# EAGLE design V1.1 (EAGLE 9.5.1)
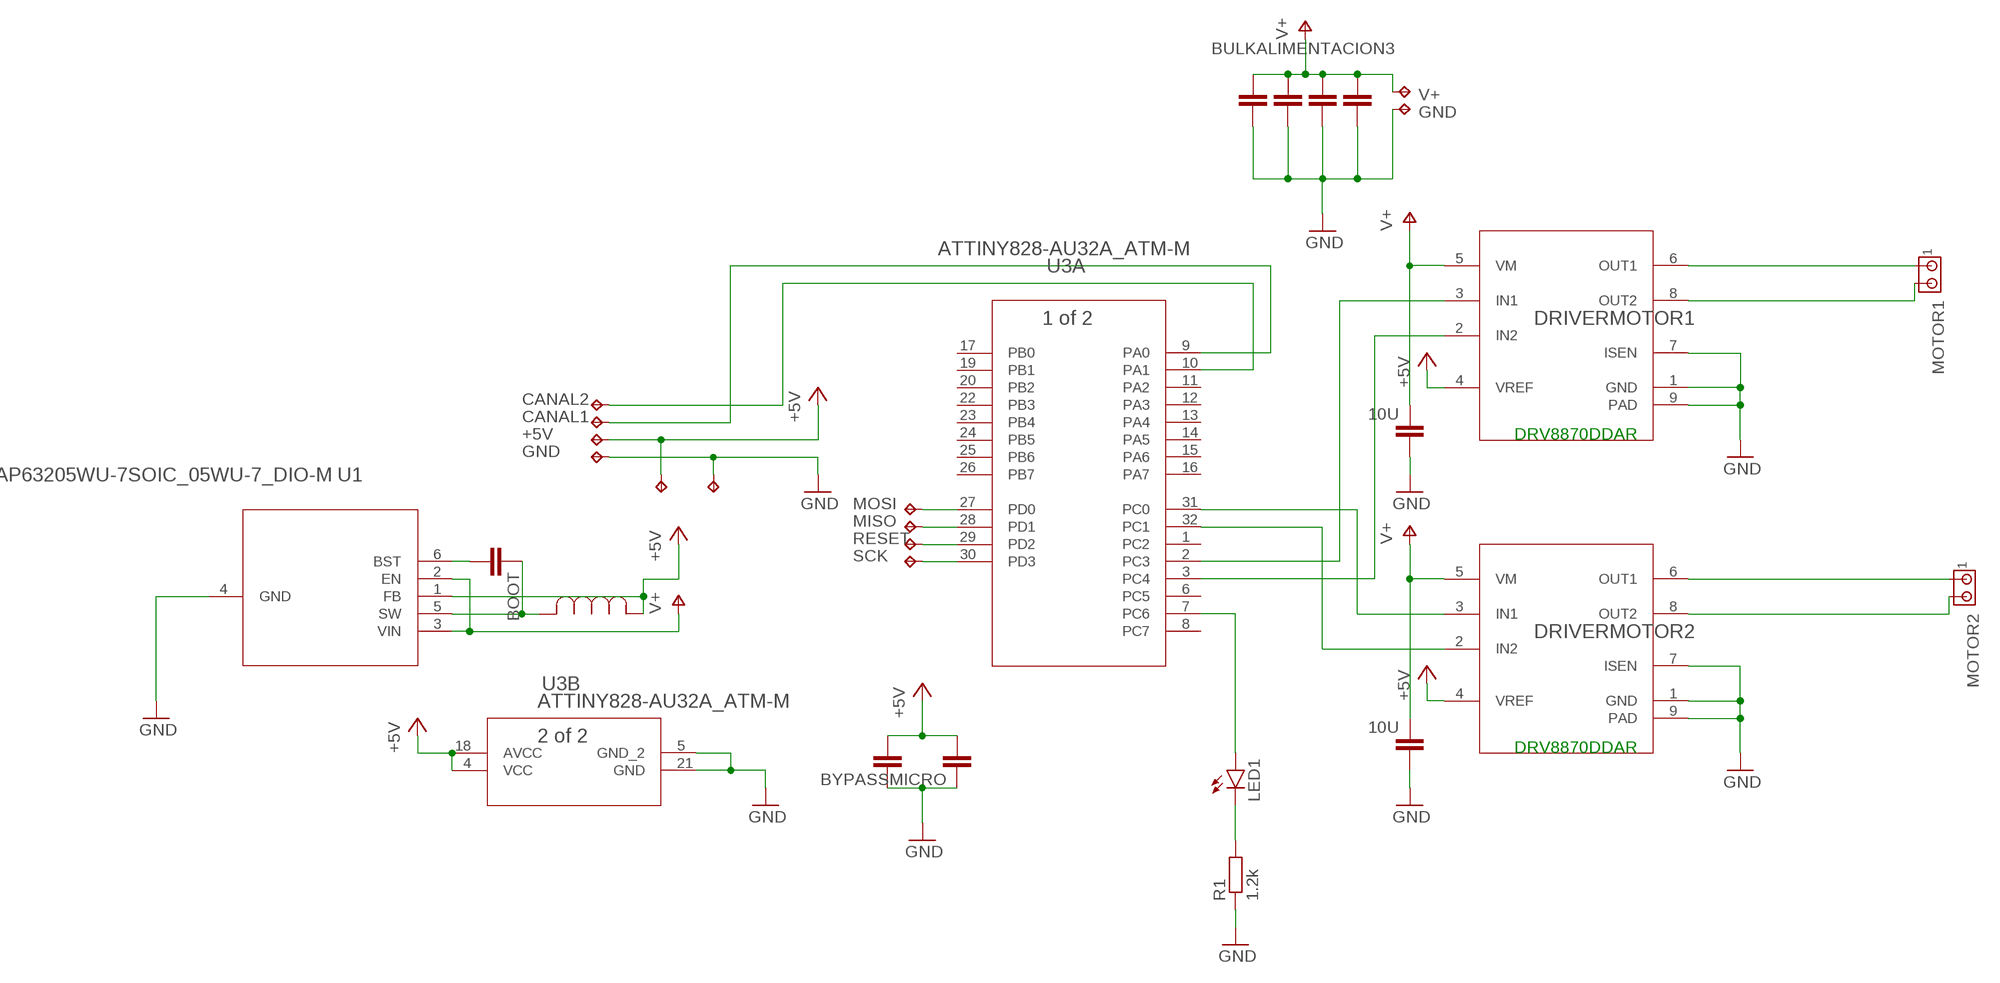
[diagram p0: schematic, sheet 1]

## Parts
BOOT  C-EUC0402  [C0402]
BULKALIMENTACION  C-EUC1206  [C1206]
BULKALIMENTACION1  C-EUC1206  [C1206]
BULKALIMENTACION2  C-EUC1206  [C1206]
BULKALIMENTACION3  C-EUC1206  [C1206]
BYPASS1  10U  C-EUC0603  [C0603]
BYPASSMICRO  C-EUC0603  [C0603]
BYPASSMICRO2  C-EUC0603  [C0603]
BYPASSMOTOR2  10U  C-EUC0603  [C0603]
DRIVERMOTOR1  DRV8870  [DDA0008H_N]
DRIVERMOTOR2  DRV8870  [DDA0008H_N]
GND  TPTP20SQ  [TP20SQ]
LED1  LEDCHIPLED_0603  [CHIPLED_0603]
MISO  TPTP12R  [TP12R]
MOTOR1  MTA02-100  [10X02MTA]
MOTOR2  MTA02-100  [10X02MTA]
R1  1.2k  R-EU_R0603  [R0603]
TP1  TPTP13SQ  [TP13SQ]
TP2  TPTP13SQ  [TP13SQ]
TP3  TPTP13SQ  [TP13SQ]
TP4  TPTP13SQ  [TP13SQ]
TP5  TPTP13SQ  [TP13SQ]
TP6  TPTP12R  [TP12R]
TP7  TPTP12R  [TP12R]
TP8  TPTP12R  [TP12R]
TP9  TPTP13SQ  [TP13SQ]
U1  AP63205WU-7SOIC_05WU-7_DIO-M  [SOIC_05WU-7_DIO-M]
U3  ATTINY828-AU32A_ATM-M  [32A_ATM-M]
U$2  INDUCTOR4.7  [IND_NRS5030T100MMGJ_TAY]
V+  TPTP20SQ  [TP20SQ]

## Nets
+5V: BYPASSMICRO2.2 BYPASSMICRO.2 DRIVERMOTOR1.4(VREF) DRIVERMOTOR2.4(VREF) TP3.TP TP9.TP U1.1(FB) U3.4(B:VCC) U3.18(B:AVCC) U$2.1
CANAL1: TP1.TP U3.9(A:PA0)
CANAL2: TP2.TP U3.10(A:PA1)
GND: BULKALIMENTACION1.2 BULKALIMENTACION2.2 BULKALIMENTACION3.2 BULKALIMENTACION.2 BYPASS1.1 BYPASSMICRO2.1 BYPASSMICRO.1 BYPASSMOTOR2.1 DRIVERMOTOR1.1(GND) DRIVERMOTOR1.7(ISEN) DRIVERMOTOR1.9(PAD) DRIVERMOTOR2.1(GND) DRIVERMOTOR2.7(ISEN) DRIVERMOTOR2.9(PAD) GND.TP R1.1 TP4.TP TP5.TP U1.4(GND) U3.5(B:GND_2) U3.21(B:GND)
MISO: TP6.TP U3.28(A:PD1)
MOSI: MISO.TP U3.27(A:PD0)
N$1: DRIVERMOTOR1.3(IN1) U3.2(A:PC3)
N$2: DRIVERMOTOR1.2(IN2) U3.3(A:PC4)
N$3: DRIVERMOTOR2.3(IN1) U3.31(A:PC0)
N$4: DRIVERMOTOR2.2(IN2) U3.32(A:PC1)
N$5: DRIVERMOTOR2.8(OUT2) MOTOR2.2
N$6: DRIVERMOTOR2.6(OUT1) MOTOR2.1
N$7: DRIVERMOTOR1.8(OUT2) MOTOR1.2
N$8: DRIVERMOTOR1.6(OUT1) MOTOR1.1
N$10: LED1.A U3.7(A:PC6)
N$15: LED1.C R1.2
N$17: BOOT.1 U1.5(SW) U$2.2
N$18: BOOT.2 U1.6(BST)
RESET: TP7.TP U3.29(A:PD2)
SCK: TP8.TP U3.30(A:PD3)
V+: BULKALIMENTACION1.1 BULKALIMENTACION2.1 BULKALIMENTACION3.1 BULKALIMENTACION.1 BYPASS1.2 BYPASSMOTOR2.2 DRIVERMOTOR1.5(VM) DRIVERMOTOR2.5(VM) U1.2(EN) U1.3(VIN) V+.TP
Unconnected: U3.1(A:PC2) U3.6(A:PC5) U3.8(A:PC7) U3.11(A:PA2) U3.12(A:PA3) U3.13(A:PA4) U3.14(A:PA5) U3.15(A:PA6) U3.16(A:PA7) U3.17(A:PB0) U3.19(A:PB1) U3.20(A:PB2) U3.22(A:PB3) U3.23(A:PB4) U3.24(A:PB5) U3.25(A:PB6) U3.26(A:PB7)

## Notes on the sheet
- DRV8870DDAR
- DRV8870DDAR

## Library data of the parts
BOOT BULKALIMENTACION BULKALIMENTACION1-BULKALIMENTACION3 BYPASS1 BYPASSMICRO BYPASSMICRO2 BYPASSMOTOR2 = rcl:C-EU: CAPACITOR, European symbol; SPICEPREFIX: C
DRIVERMOTOR1 DRIVERMOTOR2 = otrodrv:DRV8870
GND MISO TP1-TP9 V+ = testpad:TP: Test pad
LED1 = led:LED: LED OSRAM: - CHIPLED LG R971, LG N971, LY N971, LG Q971, LY Q971, LO R971, LY R971 LH N974, LH R974 LS Q976, LO Q976, LY Q976 LO Q996 - Hyper CHIPLED LW Q18S LB Q993, LB Q99A, LB R99A - SideLED LS A670, LO A670, LY A670, LG A670, LP A670 LB A673, LV A673, LT A673, LW A673 LH A674 LY A675 LS A676, LA A676, LO A676, LY A676, LW A676 LS A679, LY A679, LG A679 - Hyper Micro SIDELED® LS Y876, LA Y876, LO Y876, LY Y876 LT Y87S - SmartLED LW L88C, LW L88S LB L89C, LB L89S, LG L890 LS L89K, LO L89K, LY L89K LS L896, LA L896, LO L896, LY L896 - TOPLED LS T670, LO T670, LY T670, LG T670, LP T670 LSG T670, LSP T670, LSY T670, LOP T670, LYG T670 LG T671, LOG T671, LSG T671 LB T673, LV T673, LT T673, LW T673 LH T674 LS T676, LA T676, LO T676, LY T676, LB T676, LH T676, LSB T676, LW T676 LB T67C, LV T67C, LT T67C, LS T67K, LO T67K, LY T67K, LW E67C LS E67B, LA E67B, LO E67B, LY E67B, LB E67C, LV E67C, LT E67C LW T67C LS T679, LY T679, LG T679 LS T770, LO T770, LY T770, LG T770, LP T770 LB T773, LV T773, LT T773, LW T773 LH T774 LS E675, LA E675, LY E675, LS T675 LS T776, LA T776, LO T776, LY T776, LB T776 LHGB T686 LT T68C, LB T68C - Hyper Mini TOPLED® LB M676 - Mini TOPLED Santana® LG M470 LS M47K, LO M47K, LY M47K Source: http://www.osram.convergy.de LUXEON: - LUMILED® LXK2-PW12-R00, LXK2-PW12-S00, LXK2-PW14-U00, LXK2-PW14-V00 LXK2-PM12-R00, LXK2-PM12-S00, LXK2-PM14-U00 LXK2-PE12-Q00, LXK2-PE12-R00, LXK2-PE12-S00, LXK2-PE14-T00, LXK2-PE14-U00 LXK2-PB12-K00, LXK2-PB12-L00, LXK2-PB12-M00, LXK2-PB14-N00, LXK2-PB14-P00, LXK2-PB14-Q00 LXK2-PR12-L00, LXK2-PR12-M00, LXK2-PR14-Q00, LXK2-PR14-R00 LXK2-PD12-Q00, LXK2-PD12-R00, LXK2-PD12-S00 LXK2-PH12-R00, LXK2-PH12-S00 LXK2-PL12-P00, LXK2-PL12-Q00, LXK2-PL12-R00 Source: www.luxeon.com KINGBRIGHT: KA-3528ASYC Source: www.kingbright.com
MOTOR1 MOTOR2 = con-amp:MTA02-100: AMP connector
R1 = rcl:R-EU_: RESISTOR, European symbol; SPICEPREFIX: R
U1 = AP63205WU-7:AP63205WU-7; BUILT_BY: EMA_Matt; COPYRIGHT: Copyright (C) 2018 Accelerated Designs. All rights reserved; MANUFACTURER_PART_NUMBER: AP63205WU-7; SOURCELIBRARY: Diodes_Inc_2019-12-05; VENDOR: Diodes Inc
U3 = nuevoattiny828:ATTINY828-AU; BUILT_BY: EMA_UL_Team; MANUFACTURER_PART_NUMBER: ATTINY828-AU; SOURCELIBRARY: Atmel_2015-02-13; VENDOR: Atmel
U$2 = Inductor4.7:INDUCTOR4.7

## Board
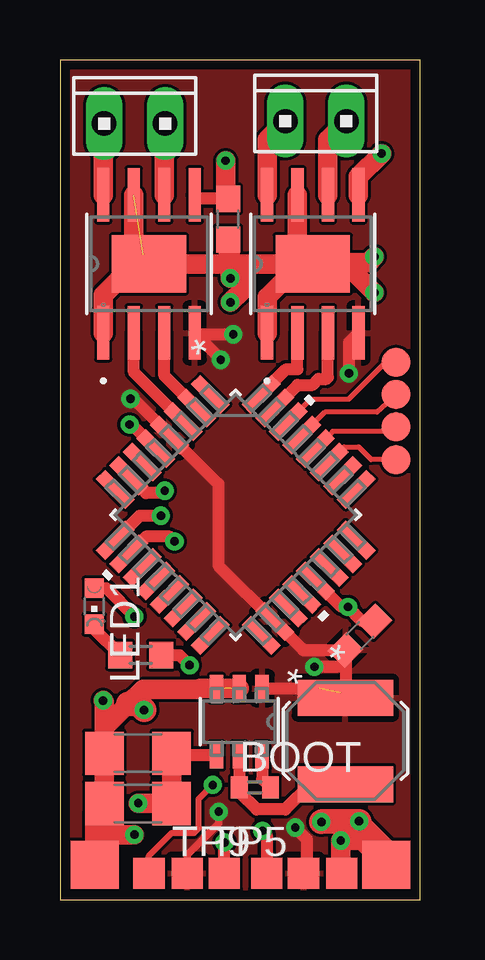
[diagram p1: board, top side]
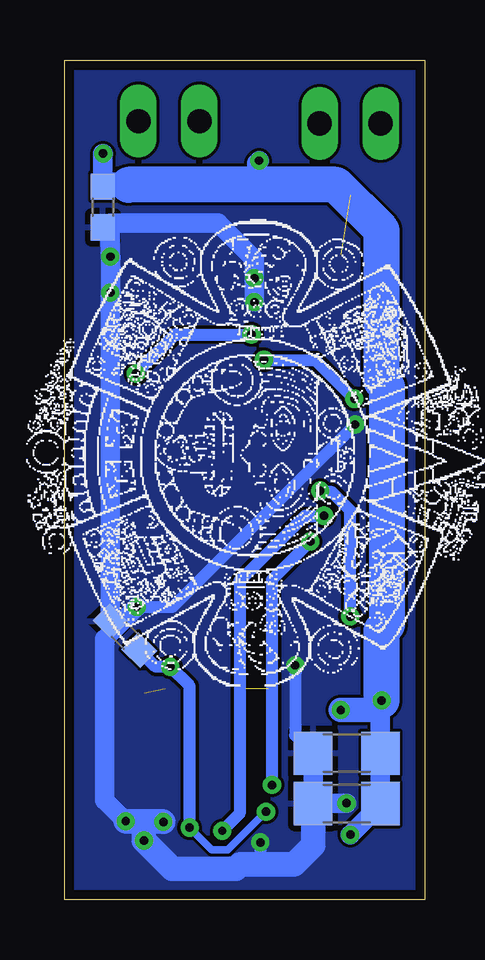
[diagram p2: board, bottom side, seen from below]

Size 15 x 35 mm. Coordinates in mm from the lower left corner, seen from the top.
Outline: 0,0 15,0 15,35 0,35 0,0
Copper layers (1*16): Top 0.035mm / dielectric 1.5mm / Bottom 0.035mm
Design rules "default *": minimum track width 6mil, minimum drill 0.35mm, track to track 5mil, track to pad 0.2mm, pad to pad 5mil, via to via 10mil, smd to smd 6mil, copper to edge 0.4mm, drill to drill 0.54mm, minimum pad ring 10mil, minimum via ring 8mil, stop-mask expansion 4mil, vias tented up to drill 0mil, thermal gap 10mil

### Footprints (pad centres in the part's own frame; a part is rotated, then mirrored left to right if it is on the bottom)
C0402 = smd 0.7 x 0.9: 1 -0.65,0; 2 0.65,0
C1206 = smd 1.6 x 1.8: 1 -1.4,0; 2 1.4,0
C0603 = smd 1.1 x 1: 1 -0.85,0; 2 0.85,0
DDA0008H_N = smd 2.21 x 0.508: 1 -2.875,1.905; 2 -2.875,0.635; 3 -2.875,-0.635; 4 -2.875,-1.905; 5 2.875,-1.905; 6 2.875,-0.635; 7 2.875,0.635; 8 2.875,1.905 | smd 2.388 x 3.099: 9 0,0
TP20SQ = smd 2 x 2: TP 0,0
CHIPLED_0603 = smd 0.8 x 0.8: A 0,-0.75; C 0,0.75
TP12R = smd 1.2 x 1.2: TP 0,0
10X02MTA = drill 1.016 long: 1 1.27,0; 2 -1.27,0
R0603 = smd 1 x 1.1: 1 -0.85,0; 2 0.85,0
TP13SQ = smd 1.3 x 1.3: TP 0,0
SOIC_05WU-7_DIO-M = smd 1.096 x 0.557: 1 -1.399,0.95; 2 -1.399,0; 3 -1.399,-0.95; 4 1.399,-0.95; 5 1.399,0; 6 1.399,0.95
32A_ATM-M = smd 1.75 x 0.55: 1 -4.3,2.8; 2 -4.3,2; 3 -4.3,1.2; 4 -4.3,0.4; 5 -4.3,-0.4; 6 -4.3,-1.2; 7 -4.3,-2; 8 -4.3,-2.8; 17 4.3,-2.8; 18 4.3,-2; 19 4.3,-1.2; 20 4.3,-0.4; 21 4.3,0.4; 22 4.3,1.2; 23 4.3,2; 24 4.3,2.8 | smd 0.55 x 1.75: 9 -2.8,-4.3; 10 -2,-4.3; 11 -1.2,-4.3; 12 -0.4,-4.3; 13 0.4,-4.3; 14 1.2,-4.3; 15 2,-4.3; 16 2.8,-4.3; 25 2.8,4.3; 26 2,4.3; 27 1.2,4.3; 28 0.4,4.3; 29 -0.4,4.3; 30 -1.2,4.3; 31 -2,4.3; 32 -2.8,4.3
IND_NRS5030T100MMGJ_TAY = smd 1.499 x 3.988: 1 -1.8,0; 2 1.8,0

### Placement (x,y rotation side)
BOOT  8.12,4.68 0 top
BULKALIMENTACION  3.25,6.1 180 bottom
BULKALIMENTACION1  3.25,6.1 0 top
BULKALIMENTACION2  3.25,4 0 top
BULKALIMENTACION3  3.25,4 180 bottom
BYPASS1  13.41,28.87 90 bottom
BYPASSMICRO  12.5,11 315 bottom
BYPASSMICRO2  12.5,11 225 top
BYPASSMOTOR2  7,28.36 90 top
DRIVERMOTOR1  3.71,26.5 90 top
DRIVERMOTOR2  10.53,26.5 90 top
GND  13.59,1.45 0 top
LED1  1.43,12.23 180 top
MISO  14,18.34 270 top
MOTOR1  3.11,32.35 0 top
MOTOR2  10.66,32.45 0 top
R1  3.36,10.19 180 top
TP1  8.61,1.1 0 top
TP2  3.71,1.1 0 top
TP3  10.15,1.1 0 top
TP4  11.74,1.1 0 top
TP5  6.85,1.1 0 top
TP6  14,19.71 270 top
TP7  14,21.06 0 top
TP8  14,22.4 0 top
TP9  5.3,1.1 0 top
U1  7.47,7.41 270 top
U3  7.32,16.04 315 top
U$2  11.89,6.61 270 top
V+  1.44,1.45 0 top

### Tracks (layer width: path | path; a pad name or v marks a point on that pad's centre or on a via)
+5V  (via drill 0.35)  (1 unrouted)
  Top 0.305: v6.62,3.66 6.62,3.18 5.3,1.86 TP9.TP
  Top 0.508: v7.22,23.56 5.68,23.56 DRIVERMOTOR1.4 6.7,22.54 v6.7,22.5 | DRIVERMOTOR2.4 12.04,23.23 v12.04,21.93 | v2.94,20.87 3.07,20.87 4.56,19.39 U3.4 6.6,17.33 6.6,13.93 U3.18 10.13,10.4 BYPASSMICRO2.2 | BYPASSMICRO2.2 U$2.1 11.69,8.61 | 8.42,8.92 U1.1 10.79,8.81 10.8,8.79 | BYPASSMICRO2.2 11.9,9.7 v10.6,9.7 | v9.8,3 10.28,2.52 10.28,1.1 TP3.TP
  Bottom 0.305: 6.63,3.68 v6.62,3.66 v6.62,3.65 8.2,2.07 8.87,2.07 v9.8,3
  Bottom 0.508: v7.22,23.56 10.41,23.56 v12.04,21.93 | v6.7,22.5 4.57,22.5 v2.94,20.87 | BYPASSMICRO2.2 11.2,9.7 v10.6,9.7 9.8,8.9 v9.8,3
  pour Top: 0,0 0,35 15,35 15,0
CANAL1  (via drill 0.35)
  Top 0.508: v8.44,2.87 8.61,2.69 TP1.TP | v4.2,16 3.32,16 U3.9
  Bottom 0.508: v8.44,2.87 7.71,3.59 7.71,13.29 5,16 v4.2,16
CANAL2  (via drill 0.35)
  Top 0.254: TP2.TP 3.71,1.83 4.65,2.77 5.58,2.77 5.78,2.96 5.78,4.19 v6.36,4.78
  Top 0.508: v4.77,14.93 4.57,15.13 3.58,15.13 U3.10
  Bottom 0.508: v6.36,4.78 6.36,13.34 v4.77,14.93
GND  (via drill 0.35)  (1 unrouted)
  Top 0.508: U3.5 2.99,19.8 v2.9,19.8 | U3.21 11.73,12.2 v12,12.2 12.6,11.6 BYPASSMICRO2.1 | 4.76,6.21 BULKALIMENTACION1.2 4.74,6.01 U1.4 | R1.1 4.98,10.19 v5.4,9.77 | TP5.TP v6.85,2.38
  Top 0.61: 3.08,27.21 3.35,26.75
  Top 0.813: DRIVERMOTOR2.9 10.36,26.9 9.89,27.36 DRIVERMOTOR2.7 | DRIVERMOTOR1.1 1.8,25.21 3.35,26.75 | DRIVERMOTOR2.9 10.1,26.6 10,26.5 | DRIVERMOTOR2.1 8.62,25.12 10,26.5 | 7.58,26.5 7.2,26.5 7.1,26.4 v7.1,25.9 7.1,27.41 BYPASSMOTOR2.1 7,26.5 DRIVERMOTOR1.9 3.48,26.73 3.48,26.88 | 7.58,26.5 10,26.5 | TP4.TP 11.7,1.14 v11.7,2.46 12.59,2.46 GND.TP 13.59,2.14 v12.46,3.27 | BULKALIMENTACION1.2 BULKALIMENTACION3.2 4.64,4.01 v3.26,4.01 | v13.1,26.8 12.86,26.56 10.28,26.56 | DRIVERMOTOR2.9 11.9,26.5 v13.1,25.3 | DRIVERMOTOR1.7 3.08,27.21 | v7.1,24.9 7.58,25.38 7.58,26.5
  Top 1.016: v12.46,3.27 10.93,3.27 v10.89,3.23
  Bottom 0.508: BYPASSMICRO2.1 12.6,11.6 v12,12.2 10.5,12.2 v2.9,19.8 | v5.4,9.77 5.4,6.85 BULKALIMENTACION1.2 | v6.85,2.38 6.85,1.48
  Bottom 0.813: BULKALIMENTACION1.2 BULKALIMENTACION3.2 4.64,4.01 v3.26,4.01 | v12.46,3.27 13.33,4.14 13.33,10.87 v12,12.2 | BYPASSMICRO2.1 13.1,21.34 13.11,21.34 v13.11,25.29 v13.1,25.3 13.09,25.31 13.09,26.79 v13.1,26.8 | v13.1,26.8 13.1,27.71 BYPASS1.1 | v13.1,26.8 13.1,28.2 8.6,28.2 7.1,26.7 v7.1,25.9 v7.1,24.9
  Bottom 1.016: v12.46,3.27 11.74,3.27 | 11.74,3.27 10.93,3.27 v10.89,3.23 | 11.74,3.27 11.7,3.22 v11.7,2.46 10.52,1.28 7.88,1.28 7.68,1.48 6.85,1.48 5.44,1.48 4.65,2.26 BULKALIMENTACION3.2
  pour Bottom: 0,0 0,35 15,35 15,0
MISO
  Top 0.2: U3.28 11.36,19.51 13.75,19.51 TP6.TP
MOSI
  Top 0.2: MISO.TP 12.96,18.34 12.44,18.87 11.84,18.87 U3.27
N$1
  Top 0.508: 4.34,23.24 DRIVERMOTOR1.3 4.34,21.84 U3.2
N$2
  Top 0.508: 3.08,23.38 DRIVERMOTOR1.2 3.08,21.98 U3.3
N$3
  Top 0.508: U3.31 9.9,21.45 10.52,21.45 10.77,21.7 11.1,21.7 11.16,21.76 DRIVERMOTOR2.3
N$4
  Top 0.508: U3.32 9.43,22.11 9.89,22.11 DRIVERMOTOR2.2
N$5
  Top 0.813: DRIVERMOTOR2.8 8.62,31.68 MOTOR2.2
N$6
  Top 0.813: DRIVERMOTOR2.6 11.16,31.68 MOTOR2.1
N$7
  Top 0.813: MOTOR1.2 1.8,32.31 DRIVERMOTOR1.8
N$8
  Top 0.813: MOTOR1.1 4.34,32.31 DRIVERMOTOR1.6
N$10  (via drill 0.35)
  Top 0.508: LED1.A 1.92,12.98 v3.1,11.8 | v4.36,17.04 4.27,16.95 3.59,16.95 U3.7
  Bottom 0.508: v4.36,17.04 4.31,16.98 3.88,16.98 3.1,16.21 v3.1,11.8
N$15
  Top 0.508: R1.2 1.43,11.27 LED1.C
N$17
  Top 0.508: 10.57,5.07 10.6,5.1 11.6,5.1 U$2.2 10.45,4.81 9.39,3.75 8.19,3.75 7.47,4.47 BOOT.1 U1.5
N$18
  Top 0.508: U1.6 8.42,5.02 BOOT.2
RESET
  Top 0.2: U3.29 11.04,20.32 13.21,20.32 TP7.TP
SCK
  Top 0.2: U3.30 10.44,20.85 12.02,20.85 13.56,22.4 TP8.TP
V+  (via drill 0.35)  (1 unrouted)
  Top 0.508: BYPASSMOTOR2.2 5.78,29.21 DRIVERMOTOR1.5
  Top 0.813: BULKALIMENTACION1.1 BULKALIMENTACION3.1 1.44,3.59 V+.TP 1.44,2.6 1.55,2.7 v3.1,2.7 | BULKALIMENTACION1.1 1.85,7.15 2.85,8.15 3.46,8.76 5.79,8.76 5.83,8.81 U1.2 | v13.4,31.1 12.44,30.14 DRIVERMOTOR2.5 | v1.8,8.3 1.85,8.25 BULKALIMENTACION1.1 | v6.9,30.8 6.9,29.31 BYPASSMOTOR2.2
  Top 1.016: 2.85,8.15 3.25,8.15 v3.5,7.9
  Bottom 0.813: v13.4,31.1 v13.41,31.09 BYPASS1.2 13.33,29.8 | v3.1,2.7 1.85,3.95 BULKALIMENTACION3.1 BULKALIMENTACION1.1 1.85,8.25 v1.8,8.3 | 7,29.8 3.7,29.8 | 7,29.8 12.35,29.8 | 7,29.8 7,30.7 v6.9,30.8
  Bottom 1.016: 13.33,29.8 12.35,29.8 | v3.5,7.9 2.2,7.9 v1.8,8.3
  Bottom 1.5: v1.8,8.3 1.8,11.22 1.57,11.45 1.57,21.38 1.8,21.61 1.8,27.9 3.7,29.8 12.35,29.8